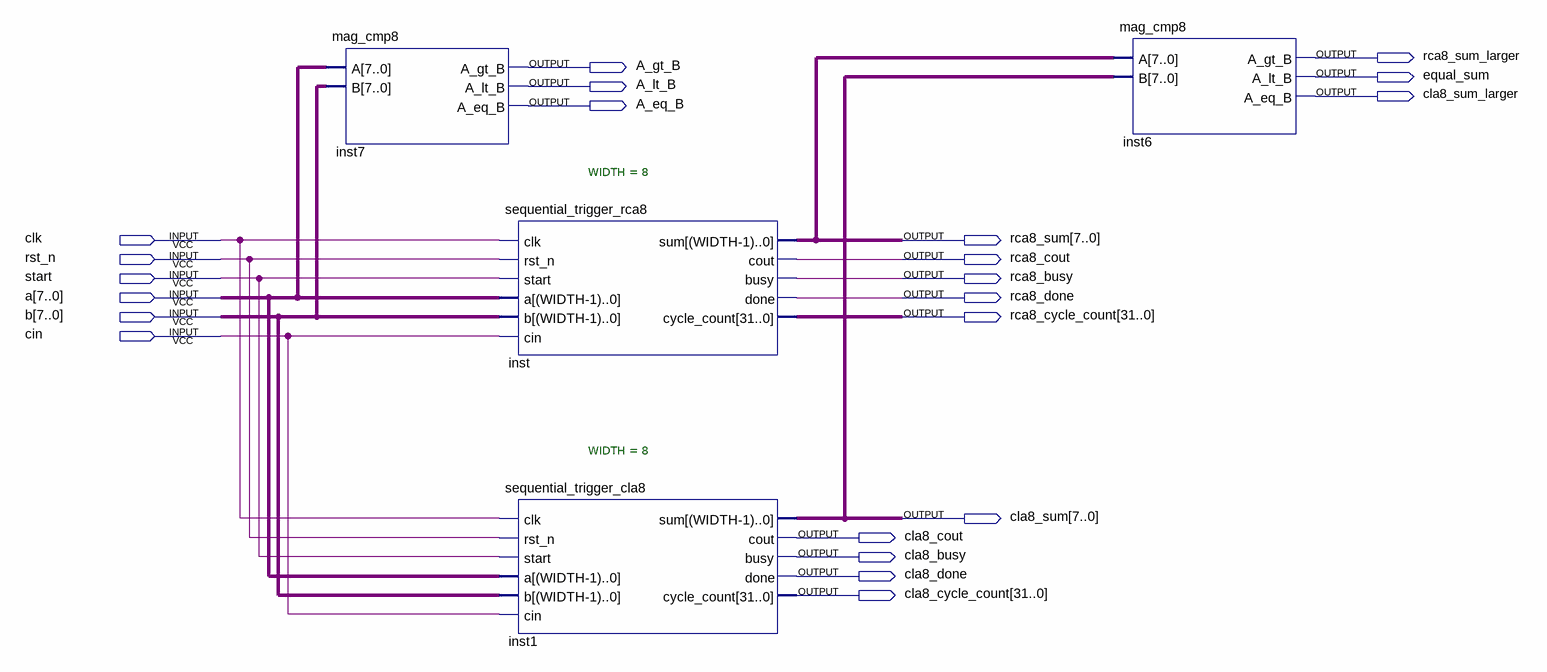
[diagram p0: schematic sheet]
// Quartus schematic top_sequential_exp.bdf as structural Verilog: 4 symbols, 22 pins
module top_sequential_exp (
  input  clk,
  input  rst_n,
  input  start,
  input  [7:0] a,
  input  [7:0] b,
  input  cin,
  output rca8_sum_larger,
  output A_gt_B,
  output equal_sum,
  output A_lt_B,
  output cla8_sum_larger,
  output A_eq_B,
  output [7:0] rca8_sum,
  output rca8_cout,
  output rca8_busy,
  output rca8_done,
  output [31:0] rca8_cycle_count,
  output [7:0] cla8_sum,
  output cla8_cout,
  output cla8_busy,
  output cla8_done,
  output [31:0] cla8_cycle_count
);

  mag_cmp8 inst7 (.A(a), .B(b), .A_gt_B(A_gt_B), .A_lt_B(A_lt_B), .A_eq_B(A_eq_B));
  sequential_trigger_rca8 #(.WIDTH(8)) inst (
    .clk(clk), .rst_n(rst_n), .start(start), .a(a), .b(b), .cin(cin), .sum(rca8_sum), .cout(rca8_cout),
    .busy(rca8_busy), .done(rca8_done), .cycle_count(rca8_cycle_count));
  sequential_trigger_cla8 #(.WIDTH(8)) inst1 (
    .clk(clk), .rst_n(rst_n), .start(start), .a(a), .b(b), .cin(cin), .sum(cla8_sum), .cout(cla8_cout),
    .busy(cla8_busy), .done(cla8_done), .cycle_count(cla8_cycle_count));
  mag_cmp8 inst6 (.A(rca8_sum), .B(cla8_sum), .A_gt_B(rca8_sum_larger), .A_lt_B(equal_sum), .A_eq_B(cla8_sum_larger));
endmodule
